# EAGLE design arduino lcd ble (EAGLE 9.6.0)
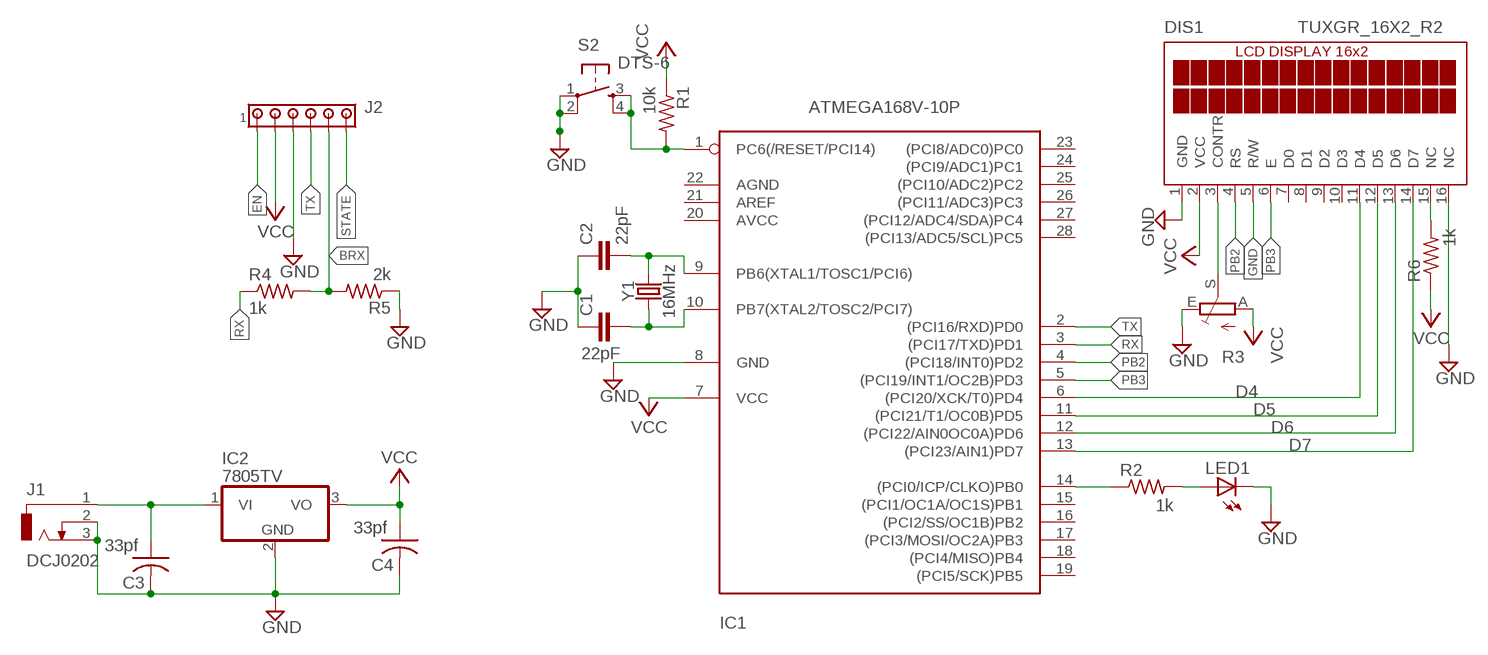
[diagram p0: schematic, sheet 1]

## Parts
C1  22pF  22PF-PTH-2.54MM-200V-5%  [CAP-PTH-2.54]
C2  22pF  22PF-PTH-2.54MM-200V-5%  [CAP-PTH-2.54]
C3  33pf  C-US025-030X050  [C025-030X050]
C4  33pf  C-US025-030X050  [C025-030X050]
DIS1  TUXGR_16X2_R2  [TUXGR_16X2_R2]
IC1  ATMEGA168V-10P  [DIL28-3]
IC2  7805TV  [TO220V]
J1  DCJ0202  [DCJ0202]
J2  MTA06-100  [10X06MTA]
LED1  LED3MM  [LED3MM]
R1  10k  R-US_0204/7  [0204/7]
R2  1k  R-US_0204/7  [0204/7]
R3  TRIM_EU-CA6V  [CA6V]
R4  1k  R-US_0204/7  [0204/7]
R5  2k  R-US_0204/7  [0204/7]
R6  1k  R-US_0204/7  [0204/7]
S2  DTS-6  [DTS-6]
Y1  16MHz  CRYSTAL-16MHZPTH-HC49US  [HC49US]

## Nets
BRX: J2.5 R4.2 R5.2
CONT: DIS1.3(CONTR) R3.S
D4: DIS1.11(D4) IC1.6((PCI20/XCK/T0)PD4)
D5: DIS1.12(D5) IC1.11((PCI21/T1/OC0B)PD5)
D6: DIS1.13(D6) IC1.12((PCI22/AIN0OC0A)PD6)
D7: DIS1.14(D7) IC1.13((PCI23/AIN1)PD7)
EN: J2.1
GND: C1.1 C2.1 C3.2 C4.2 DIS1.1(GND) DIS1.5(R/W) DIS1.16(NC) IC1.8(GND) IC2.2(GND) J1.2 J1.3 J2.3 LED1.K(C) R3.E R5.1 S2.1 S2.2
N$1: C2.2 IC1.9(PB6(XTAL1/TOSC1/PCI6)) Y1.2
N$2: C1.2 IC1.10(PB7(XTAL2/TOSC2/PCI7)) Y1.1
N$3: DIS1.15(NC) R6.2
N$5: IC1.14((PCI0/ICP/CLKO)PB0) R2.1
N$6: LED1.A R2.2
N$7: C3.1 IC2.1(VI) J1.1
N$8: IC1.1(PC6(/RESET/PCI14)) R1.2 S2.3 S2.4
PB2: DIS1.4(RS) IC1.4((PCI18/INT0)PD2)
PB3: DIS1.6(E) IC1.5((PCI19/INT1/OC2B)PD3)
RX: IC1.3((PCI17/TXD)PD1) R4.1
STATE: J2.6
TX: IC1.2((PCI16/RXD)PD0) J2.4
VCC: C4.1 DIS1.2(VCC) IC1.7(VCC) IC2.3(VO) J2.2 R1.1 R3.A R6.1
Unconnected: DIS1.7(D0) DIS1.8(D1) DIS1.9(D2) DIS1.10(D3) IC1.15((PCI1/OC1A/OC1S)PB1) IC1.16((PCI2/SS/OC1B)PB2) IC1.17((PCI3/MOSI/OC2A)PB3) IC1.18((PCI4/MISO)PB4) IC1.19((PCI5/SCK)PB5) IC1.20(AVCC) IC1.21(AREF) IC1.22(AGND) IC1.23((PCI8/ADC0)PC0) IC1.24((PCI9/ADC1)PC1) IC1.25((PCI10/ADC2)PC2) IC1.26((PCI11/ADC3)PC3) IC1.27((PCI12/ADC4/SDA)PC4) IC1.28((PCI13/ADC5/SCL)PC5)

## Library data of the parts
C1 C2 = SparkFun-Capacitors:22PF: 22pF ceramic capacitors A capacitor is a passive two-terminal electrical component used to store electrical energy temporarily in an electric field.; PROD_ID: CAP-09128
C3 C4 = resistor:C-US: CAPACITOR, American symbol
DIS1 = display-lcd:TUXGR_16X2_R2: Tuxgraphics LCD display 16x2 characters reflective, without background light Source: tuxgr_12x2_r2.pdf; OC_FARNELL: unknown; OC_NEWARK: unknown
IC1 = adafruit:ATMEGA168*P: MICROCONTROLLER 16 kBytes FLASH 1 kBytes SRAM 512 Bytes EEPROM USART 8-channel 10 bit ADC
IC2 = linear:78*: Positive VOLTAGE REGULATOR Source: http://cache.national.com/ds/LM/LM78L05.pdf http://www.fairchildsemi.com/ds/LM/LM7805.pdf
J1 = con-jack:DCJ0202: DC POWER JACK Source: DCJ0202.pdf; OC_FARNELL: unknown; OC_NEWARK: unknown
J2 = con-amp:MTA06-100: AMP connector Connection corrected 2014-09-19
LED1 = adafruit:LED: LED OSRAM: - CHIPLED LG R971, LG N971, LY N971, LG Q971, LY Q971, LO R971, LY R971 LH N974, LH R974 LS Q976, LO Q976, LY Q976 LO Q996 - Hyper CHIPLED LW Q18S LB Q993, LB Q99A, LB R99A - SideLED LS A670, LO A670, LY A670, LG A670, LP A670 LB A673, LV A673, LT A673, LW A673 LH A674 LY A675 LS A676, LA A676, LO A676, LY A676, LW A676 LS A679, LY A679, LG A679 - Hyper Micro SIDELED® LS Y876, LA Y876, LO Y876, LY Y876 LT Y87S - SmartLED LW L88C, LW L88S LB L89C, LB L89S, LG L890 LS L89K, LO L89K, LY L89K LS L896, LA L896, LO L896, LY L896 - TOPLED LS T670, LO T670, LY T670, LG T670, LP T670 LSG T670, LSP T670, LSY T670, LOP T670, LYG T670 LG T671, LOG T671, LSG T671 LB T673, LV T673, LT T673, LW T673 LH T674 LS T676, LA T676, LO T676, LY T676, LB T676, LH T676, LSB T676, LW T676 LB T67C, LV T67C, LT T67C, LS T67K, LO T67K, LY T67K, LW E67C LS E67B, LA E67B, LO E67B, LY E67B, LB E67C, LV E67C, LT E67C LW T67C LS T679, LY T679, LG T679 LS T770, LO T770, LY T770, LG T770, LP T770 LB T773, LV T773, LT T773, LW T773 LH T774 LS E675, LA E675, LY E675, LS T675 LS T776, LA T776, LO T776, LY T776, LB T776 LHGB T686 LT T68C, LB T68C - Hyper Mini TOPLED® LB M676 - Mini TOPLED Santana® LG M470 LS M47K, LO M47K, LY M47K Source: http://www.osram.convergy.de/
R1 R2 R4-R6 = adafruit:R-US_: RESISTOR, American symbol
R3 = pot:TRIM_EU-: POTENTIOMETER
S2 = switch-tact:DTS-6
Y1 = SparkFun-Clocks:CRYSTAL-16MHZ: 16MHz Crystal Digikey Example <http://www.digikey.com/product-search/en?keywords=535-9122-1-ND> Frequency: 16MHz Frequency Stability: ±50ppm Frequency Tolerance: ±20ppm Load Capacitance: 18pF SparkFun Products: Pro Micro -5V/16MHz <https://www.sparkfun.com/products/12640> SparkFun Serial Enabled LCD Kit <https://www.sparkfun.com/products/10097>; PROD_ID: XTAL-08181; SF_ID: COM-00536

## Board
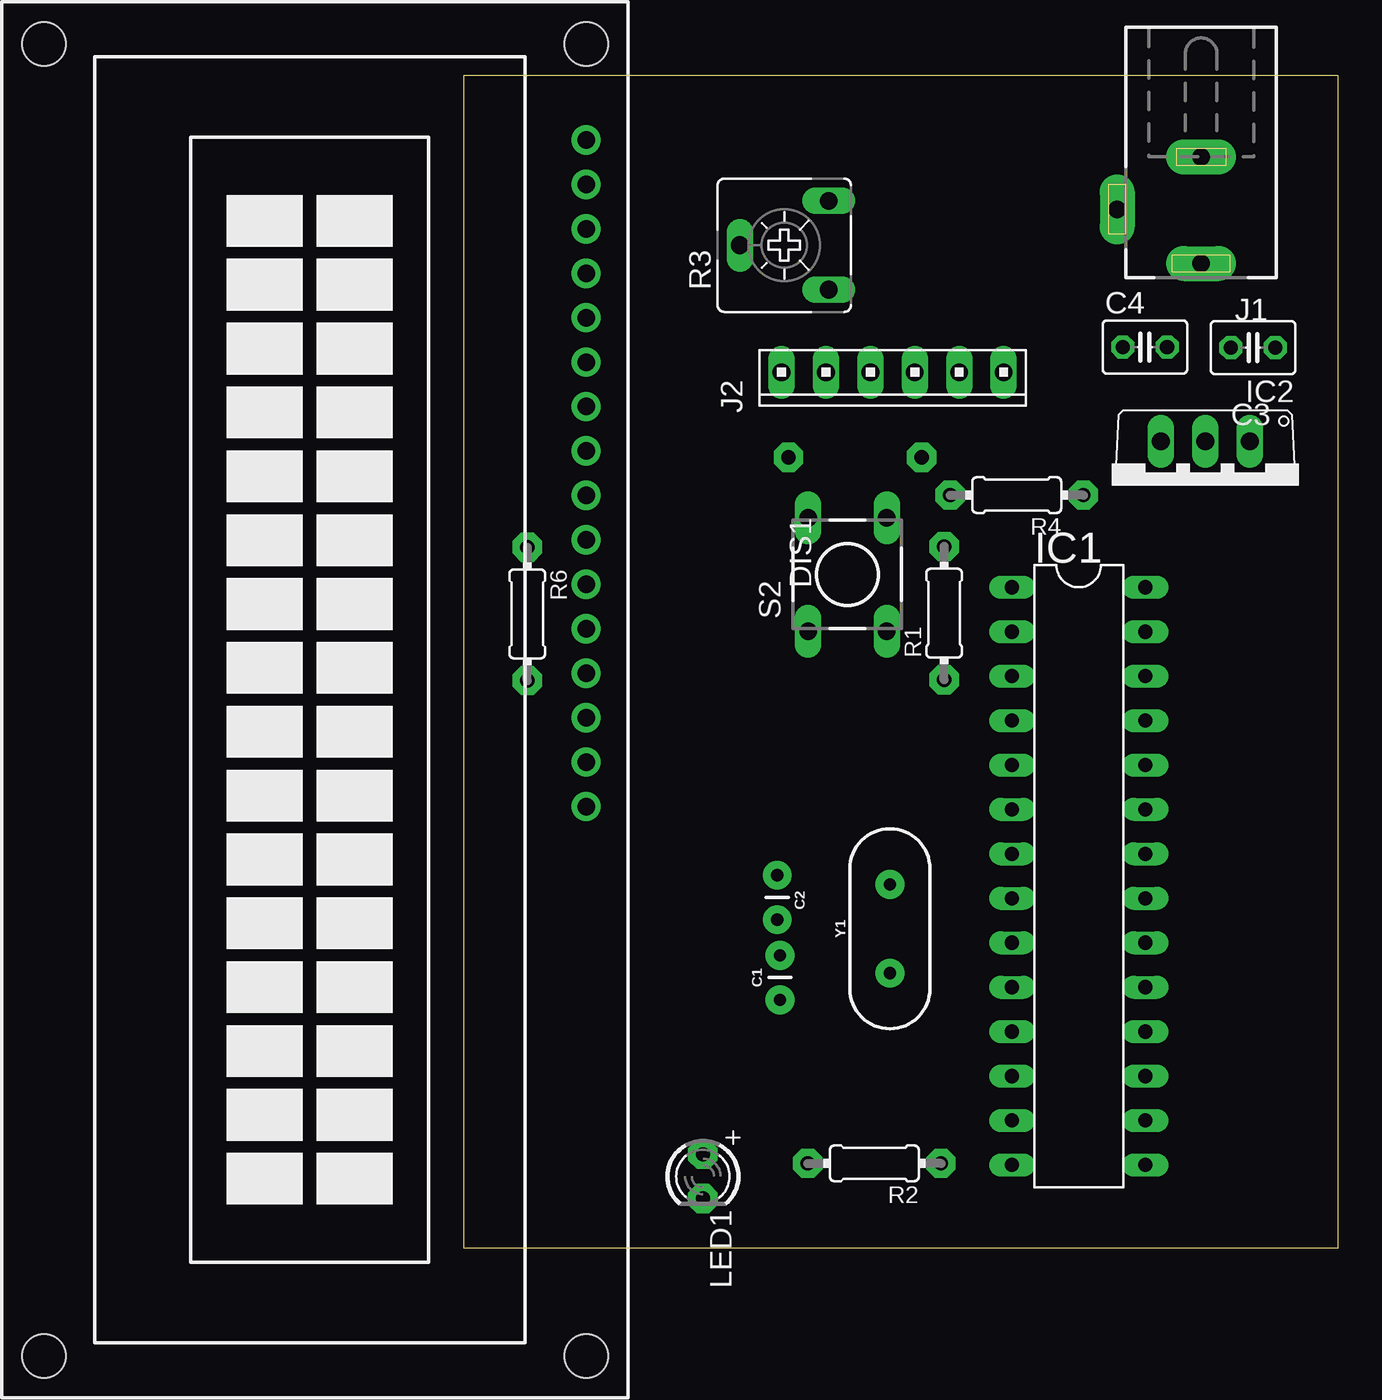
[diagram p1: board, top side]
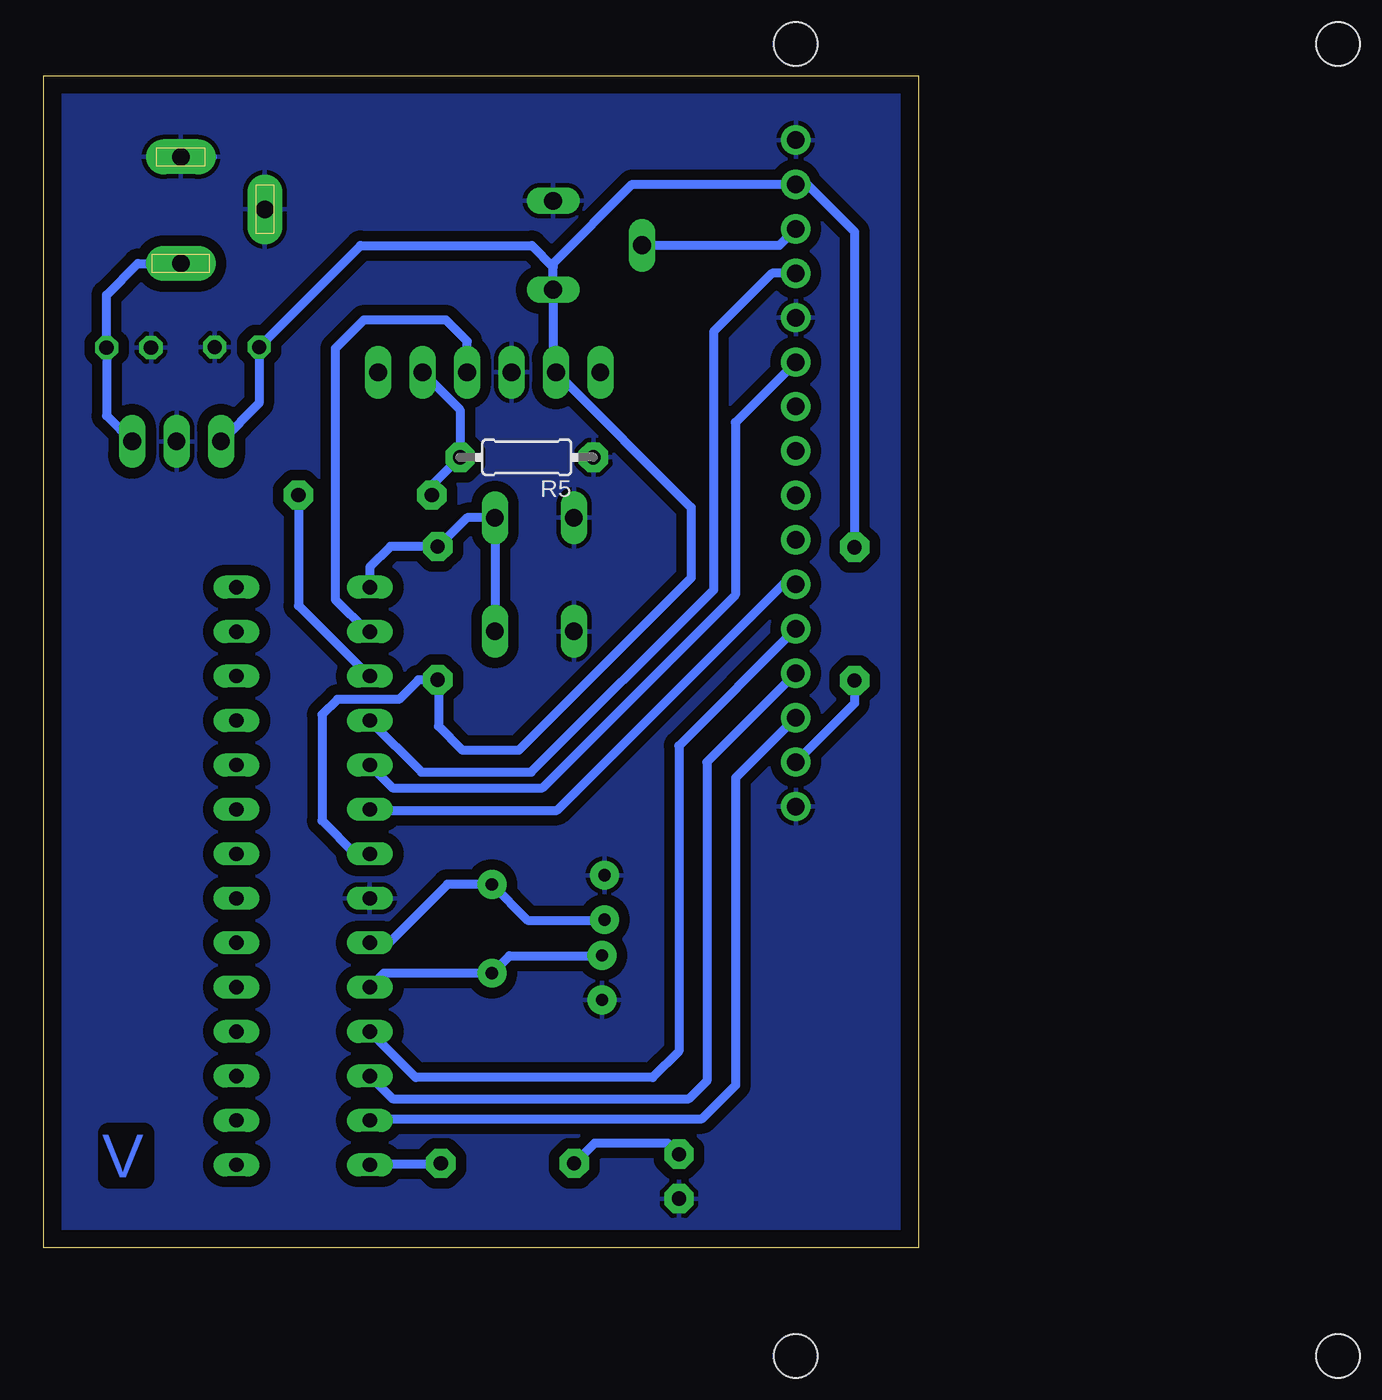
[diagram p2: board, bottom side, seen from below]

Size 50 x 67 mm. Coordinates in mm from the lower left corner, seen from the top.
Outline: 0,0 50,0 50,67 0,67 0,0
Copper layers (1*16): Top 0.035mm / dielectric 1.5mm / Bottom 0.035mm
Design rules "default": minimum track width 6mil, minimum drill 0.35mm, track to track 6mil, track to pad 6mil, pad to pad 6mil, via to via 6mil, smd to smd 6mil, copper to edge 40mil, drill to drill 6mil, minimum pad ring 10mil, minimum via ring 8mil, stop-mask expansion 4mil, vias tented up to drill 0mil, thermal gap 10mil

### Footprints (pad centres in the part's own frame; a part is rotated, then mirrored left to right if it is on the bottom)
CAP-PTH-2.54 = drill 0.7 pad 1.651: 1 -1.27,0; 2 1.27,0
C025-030X050 = drill 0.813 octagon: 1 -1.27,0; 2 1.27,0
TUXGR_16X2_R2 = drill 1 pad 1.676: 1 -32,15.5; 2 -29.46,15.5; 3 -26.92,15.5; 4 -24.38,15.5; 5 -21.84,15.5; 6 -19.3,15.5; 7 -16.76,15.5; 8 -14.22,15.5; 9 -11.68,15.5; 10 -9.14,15.5; 11 -6.6,15.5; 12 -4.06,15.5; 13 -1.52,15.5; 14 1.02,15.5; 15 3.56,15.5; 16 6.1,15.5 | hole 2.5: -37.5,-15.5; 37.5,-15.5; -37.5,15.5; 37.5,15.5
DIL28-3 = drill 0.813 long: 1 -16.51,-3.81; 2 -13.97,-3.81; 3 -11.43,-3.81; 4 -8.89,-3.81; 5 -6.35,-3.81; 6 -3.81,-3.81; 7 -1.27,-3.81; 8 1.27,-3.81; 9 3.81,-3.81; 10 6.35,-3.81; 11 8.89,-3.81; 12 11.43,-3.81; 13 13.97,-3.81; 14 16.51,-3.81; 15 16.51,3.81; 16 13.97,3.81; 17 11.43,3.81; 18 8.89,3.81; 19 6.35,3.81; 20 3.81,3.81; 21 1.27,3.81; 22 -1.27,3.81; 23 -3.81,3.81; 24 -6.35,3.81; 25 -8.89,3.81; 26 -11.43,3.81; 27 -13.97,3.81; 28 -16.51,3.81
TO220V = drill 1.016 long: 1 -2.54,-2.54; 2 0,-2.54; 3 2.54,-2.54
DCJ0202 = drill 1 pad 2 long: 1 0,3.1; 2 4.8,0; 3 0,-3
10X06MTA = drill 1.016 long: 1 6.35,0; 2 3.81,0; 3 1.27,0; 4 -1.27,0; 5 -3.81,0; 6 -6.35,0
LED3MM = drill 0.813 pad 1.676 octagon: A -1.27,0; K 1.27,0
0204/7 = drill 0.813 pad 1.676 octagon: 1 -3.81,0; 2 3.81,0
CA6V = drill 1.016 long: A -2.54,-2.54; E 2.54,-2.54; S 0,2.54
DTS-6 = drill 1 long: 1 -3.25,2.25; 2 3.25,2.25; 3 -3.25,-2.25; 4 3.25,-2.25
HC49US = drill 0.7 pad 1.651: 1 -2.54,0; 2 2.54,0

### Placement (x,y rotation side)
C1  18.09,15.46 90 top
C2  17.94,20.04 270 top
C3  45.14,51.47 180 top
C4  38.96,51.5 0 top
DIS1  -8.49,31.34 270 top
IC1  35.17,21.26 270 top
IC2  42.41,43.57 180 top
J1  42.17,59.37 180 top
J2  24.53,50.06 180 top
LED1  13.69,4.09 270 top
R1  27.48,36.29 90 top
R2  23.49,4.84 180 top
R3  18.34,57.32 90 top
R4  31.63,43.04 180 top
R5  22.39,45.2 180 bottom
R6  3.65,36.25 270 top
S2  21.95,38.5 90 top
Y1  24.38,18.25 90 top

### Tracks (layer width: path | path; a pad name or v marks a point on that pad's centre or on a via)
BRX
  Bottom 0.508: R4.2 27.82,43.58 R5.2 26.2,47.92 J2.5
CONT
  Bottom 0.508: R3.S 7.95,57.32 DIS1.3
D4
  Bottom 0.508: IC1.6 31.31,25.02 20.66,25.02 7.74,37.94 DIS1.11
D5
  Bottom 0.508: DIS1.12 13.7,28.71 13.7,11.25 15.2,9.75 28.74,9.75 IC1.11
D6
  Bottom 0.508: DIS1.13 12.1,27.77 12.1,9.55 13.12,8.53 30.06,8.53 IC1.12
D7
  Bottom 0.508: DIS1.14 10.45,26.88 10.45,9.3 12.36,7.39 31.26,7.39 IC1.13
GND
  Bottom 0.508: J1.3 40.37,62.37
  pour Bottom (isolate 0.61): 0.05,67 0.05,-0.05 49.95,-0.05 49.95,67
N$1
  Bottom 0.508: C2.2 17.97,18.74 22.33,18.74 Y1.2 26.92,20.79 30.26,17.45 IC1.9
N$2
  Bottom 0.508: C1.2 18.11,16.71 23.38,16.71 Y1.1 30.56,15.71 IC1.10
N$3
  Bottom 0.508: R6.2 3.65,31.14 DIS1.15
N$5
  Bottom 0.508: R2.1 27.34,4.8 31.31,4.8 IC1.14
N$6
  Bottom 0.508: LED1.A 14.34,6.01 18.5,6.01 R2.2
N$7
  Bottom 0.508: J1.1 44.62,56.27 46.41,54.48 C3.1 46.41,47.57 IC2.1
N$8
  Bottom 0.508: S2.3 S2.4 25.8,41.75 26.98,40.57 27.01,40.57 R1.2 30.18,40.1 31.36,38.92 IC1.1
PB2
  Bottom 0.508: IC1.4 28.41,27.2 22.13,27.2 11.71,37.62 11.71,52.37 8.36,55.72 DIS1.4
PB3
  Bottom 0.508: IC1.5 30.06,26.31 21.49,26.31 10.46,37.34 10.46,47.19 DIS1.6
RX
  Bottom 0.508: R4.1 35.44,36.72 31.41,32.69 IC1.3
TX
  Bottom 0.508: IC1.2 31.49,35.23 33.34,37.08 33.34,51.42 31.71,53.04 27.01,53.04 25.8,51.83 J2.4
VCC
  Bottom 0.508: IC2.3 37.69,48.29 C4.1 31.89,57.3 22.1,57.3 20.88,56.08 R3.A | DIS1.2 | DIS1.2 16.36,60.8 20.88,56.28 R3.A | DIS1.2 6.36,60.8 3.65,58.09 R6.1 | R3.A 20.88,50.22 J2.2 13,42.34 13,38.3 22.85,28.45 26.05,28.45 27.43,29.83 27.43,32.43 R1.1 28.58,32.48 29.69,31.37 33.21,31.37 34.09,30.49 34.09,24.43 32.19,22.53 IC1.7

### Text on the board
Bottom: V